# Altium schematic sheet indicators.SchDoc
size A4
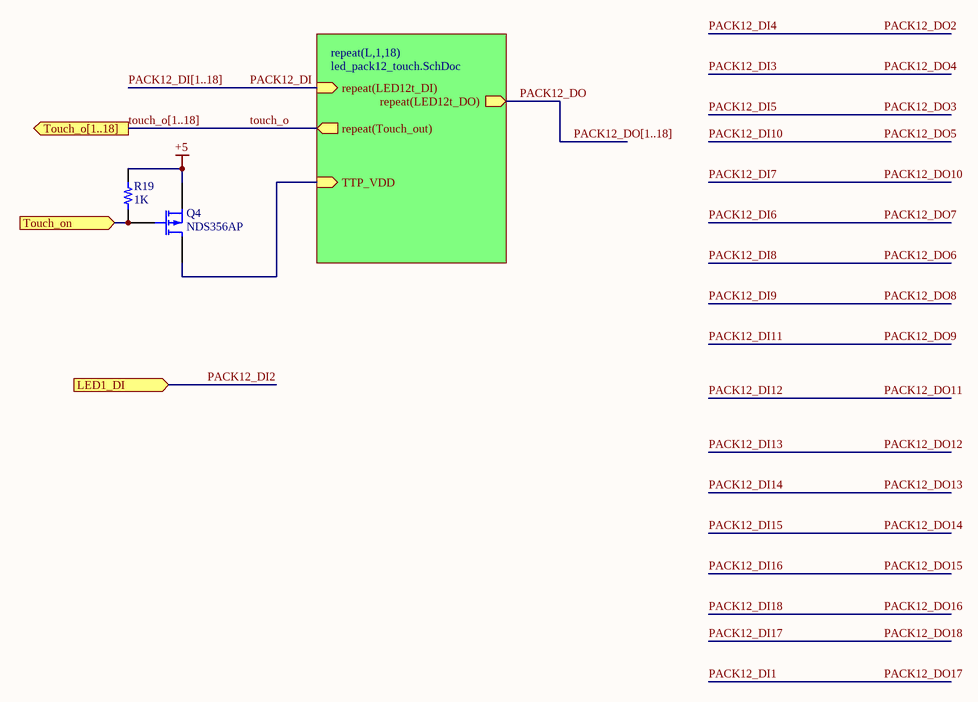
[diagram p0: indicators.SchDoc]

## Parts
Q4  NDS356AP  [soT95p280x130-3n]
R19  1K  [0603R]

## Sub-sheets
repeat(L,1,18) = led_pack12_touch.SchDoc: TTP_VDD (in), repeat(Touch_out) (out), repeat(LED12t_DO) (out), repeat(LED12t_DI) (in)

## Ports
LED1_DI (in), Touch_o[1..18] (out), Touch_on (in)

## Nets
+5: Q4.3(S) R19.1
PACK12_DI: sheet repeat(L,1,18)/repeat(LED12t_DI)
PACK12_DI2: port LED1_DI
PACK12_DO: sheet repeat(L,1,18)/repeat(LED12t_DO)
touch_o: sheet repeat(L,1,18)/repeat(Touch_out)
Touch_on: Q4.2(G) R19.2 ; port Touch_on
NetQ4_1: Q4.1(D) ; sheet repeat(L,1,18)/TTP_VDD

## Buses and harness runs
bus PACK12_DI[1..18]
bus PACK12_DO[1..18]
bus touch_o[1..18] = port Touch_o[1..18]

## Library data of the parts
Q4 = MOSFET-P: P-Channel MOSFET SOT23; pin to pad: 1>3 2>1 3>2; Published: 8-Jun-2000; LatestRevisionDate: 17-Jul-2002; LatestRevisionNote: Re-released for DXP Platform.; PackageVersion: 1995/1996; PackageReference: E3; Publisher: Altium Limited; PackageDescription: TO, Flat Index; 3 In-Line, Axial Leads; Body Dia. 4.6mm; Lead Dia. 0.5 mm (max)
R19 = Resistor: RES SMD 0603; Part Number: RCS0805100KFKEA; Value: 1K